# EAGLE design Multi_STM32_V0.1 (EAGLE 6.5.0)
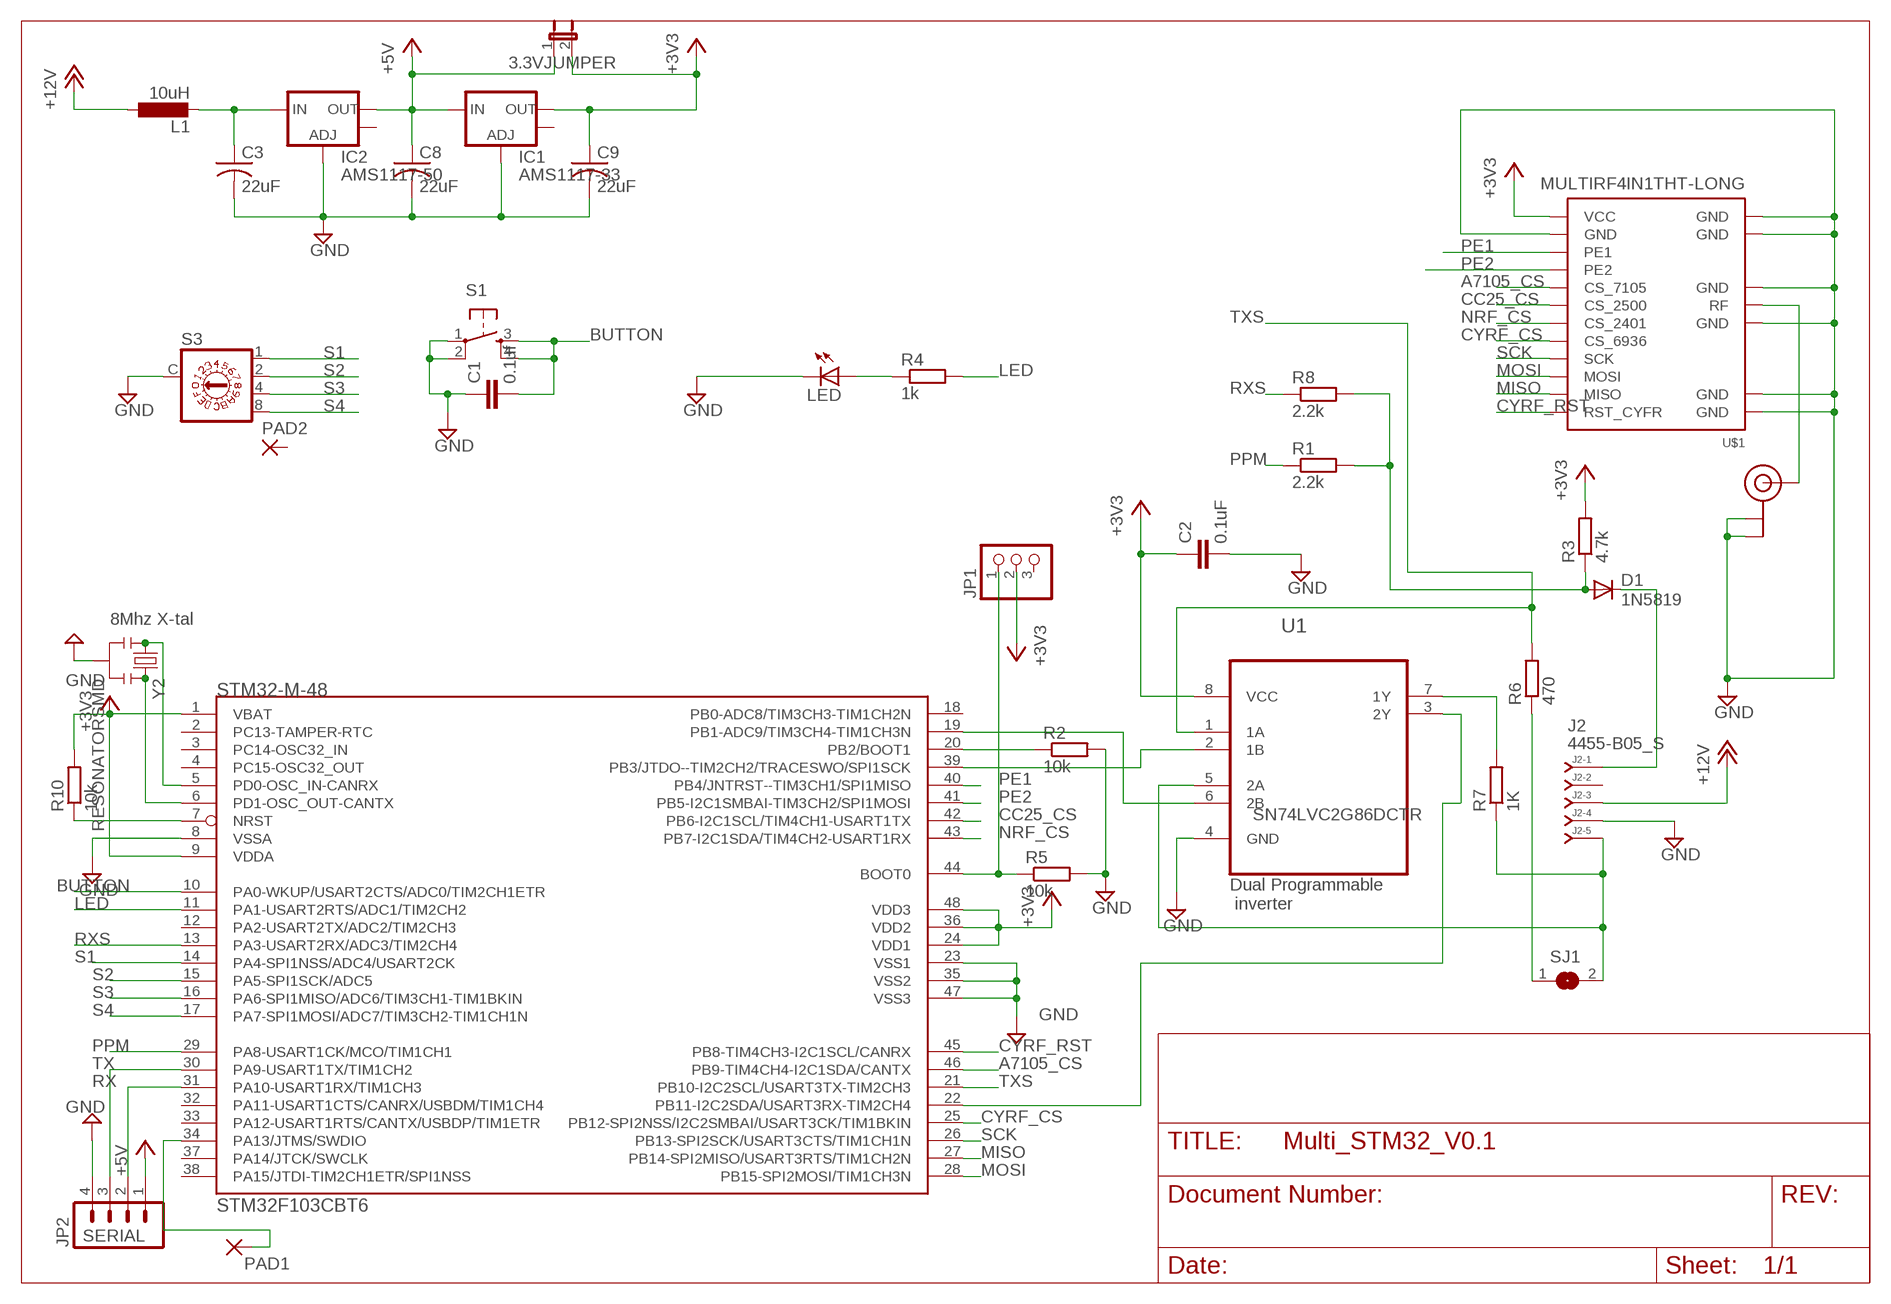
[diagram p0: schematic, sheet 1]

## Parts
3.3VJUMPER  JUMPER-2PTH  [1X02]
C1  0.1uf  C-EUC0805  [C0805]
C2  0.1uF  C-EUC0805  [C0805]
C3  22uF  C-USC1206  [C1206]
C8  22uF  C-USC1206  [C1206]
C9  22uF  C-USC1206  [C1206]
D1  1N5819  DIODESMA-ALT  [SMA-DIODE_ALT]
IC1  AMS1117-33  V_REG_LM1117SOT223  [SOT223]
IC2  AMS1117-50  V_REG_LM1117SOT223  [SOT223]
J2  4455-B05_S  [4455-B05]
JP1  PINHD-1X3  [1X03]
JP2  SERIAL  M04PTH  [1X04]
L1  10uH  L-EUL1812  [L1812]
LED  LED3MM  [LED3MM]
PAD1  SMD2  [SMD1,27-2,54]
PAD2  1,6/0,8  [1,6/0,8]
R1  2.2k  R-EU_R0805  [R0805]
R2  10k  R-EU_R0805  [R0805]
R3  4.7k  R-EU_R0805  [R0805]
R4  1k  R-EU_R0805  [R0805]
R5  10k  R-EU_R0805  [R0805]
R6  470  R-EU_R0805  [R0805]
R7  1K  R-EU_R0805  [R0805]
R8  2.2k  R-EU_R0805  [R0805]
R10  10k  R-EU_R0805  [R0805]
S1  TAC_SWITCHPTH  [TACTILE-PTH]
S3  A1353HEX  [A1353HEX]
SJ1  SJ  [SJ]
STM32F103CBT6  STM32-M-48  [LQFP48]
U1  SN74LVC2G00DCTR  [SOP65P400X130-8N]
U$1  MULTIRF4IN1THT-LONG  [MULTIRF4IN1-THT-LONG]
U$2  U.FL  [U.FL]
Y2  RESONATORSMD  [RESONATOR-SMD]

## Nets
+3V3: 3.3VJUMPER.2 C2.1 C9.1 IC1.2(OUT) JP1.2 R3.2 R10.2 STM32F103CBT6.1(VBAT) STM32F103CBT6.9(VDDA) STM32F103CBT6.24(VDD1) STM32F103CBT6.36(VDD2) STM32F103CBT6.48(VDD3) U1.8(VCC) U$1.VCC
+5V: 3.3VJUMPER.1 C8.1 IC1.3(IN) IC2.2(OUT) JP2.1
+12V: J2.3 L1.1
A7105_CS: STM32F103CBT6.46(PB9-TIM4CH4-I2C1SDA/CANTX) U$1.CS_7105
BUTTON: C1.2 S1.3 S1.4 STM32F103CBT6.10(PA0-WKUP/USART2CTS/ADC0/TIM2CH1ETR)
CC25_CS: STM32F103CBT6.42(PB6-I2C1SCL/TIM4CH1-USART1TX) U$1.CS_2500
CYRF_CS: STM32F103CBT6.25(PB12-SPI2NSS/I2C2SMBAI/USART3CK/TIM1BKIN) U$1.CS_6936
CYRF_RST: STM32F103CBT6.45(PB8-TIM4CH3-I2C1SCL/CANRX) U$1.RST_CYFR
GND: C1.1 C2.2 C3.2 C8.2 C9.2 IC1.1(ADJ) IC2.1(ADJ) J2.4 JP2.4 LED.K(C) R2.2 R5.2 S1.1 S1.2 S3.C STM32F103CBT6.8(VSSA) STM32F103CBT6.23(VSS1) STM32F103CBT6.35(VSS2) STM32F103CBT6.47(VSS3) U1.4(GND) U$1.GND U$1.GND@1(GND) U$1.GND@2(GND) U$1.GND@3(GND) U$1.GND@4(GND) U$1.GND@5(GND) U$1.GND@6(GND) U$2.P$1(GND) U$2.P$2(GND) Y2.2
LED: R4.2 STM32F103CBT6.11(PA1-USART2RTS/ADC1/TIM2CH2)
MISO: STM32F103CBT6.27(PB14-SPI2MISO/USART3RTS/TIM1CH2N) U$1.MISO
MOSI: STM32F103CBT6.28(PB15-SPI2MOSI/TIM1CH3N) U$1.MOSI
N$1: R6.1 SJ1.1
N$2: STM32F103CBT6.5(PD0-OSC_IN-CANRX) Y2.1
N$3: STM32F103CBT6.6(PD1-OSC_OUT-CANTX) Y2.3
N$4: C3.1 IC2.3(IN) L1.2
N$5: STM32F103CBT6.39(PB3/JTDO--TIM2CH2/TRACESWO/SPI1SCK) U1.2(1B)
N$6: STM32F103CBT6.22(PB11-I2C2SDA/USART3RX-TIM2CH4) U1.3(2Y)
N$8: PAD1.1(P) STM32F103CBT6.34(PA13/JTMS/SWDIO)
N$9: R7.2 U1.7(1Y)
N$10: J2.5 R7.1 SJ1.2 U1.5(2A)
N$11: LED.A R4.1
N$12: R10.1 STM32F103CBT6.7(NRST)
N$13: STM32F103CBT6.19(PB1-ADC9/TIM3CH4-TIM1CH3N) U1.6(2B)
N$15: D1.A R1.2 R3.1 R8.2
N$16: U$1.RF U$2.P$3(SIGNAL)
N$18: D1.C J2.1
N$23: JP1.1 R5.1 STM32F103CBT6.44(BOOT0)
N$26: R2.1 STM32F103CBT6.20(PB2/BOOT1)
NRF_CS: STM32F103CBT6.43(PB7-I2C1SDA/TIM4CH2-USART1RX) U$1.CS_2401
PE1: STM32F103CBT6.40(PB4/JNTRST--TIM3CH1/SPI1MISO) U$1.PE1
PE2: STM32F103CBT6.41(PB5-I2C1SMBAI-TIM3CH2/SPI1MOSI) U$1.PE2
PPM: R1.1 STM32F103CBT6.29(PA8-USART1CK/MCO/TIM1CH1)
RX: JP2.2 STM32F103CBT6.31(PA10-USART1RX/TIM1CH3)
RXS: R8.1 STM32F103CBT6.13(PA3-USART2RX/ADC3/TIM2CH4)
S1: S3.1 STM32F103CBT6.14(PA4-SPI1NSS/ADC4/USART2CK)
S2: S3.2 STM32F103CBT6.15(PA5-SPI1SCK/ADC5)
S3: S3.4 STM32F103CBT6.16(PA6-SPI1MISO/ADC6/TIM3CH1-TIM1BKIN)
S4: S3.8 STM32F103CBT6.17(PA7-SPI1MOSI/ADC7/TIM3CH2-TIM1CH1N)
SCK: STM32F103CBT6.26(PB13-SPI2SCK/USART3CTS/TIM1CH1N) U$1.SCK
TX: JP2.3 STM32F103CBT6.30(PA9-USART1TX/TIM1CH2)
TXS: R6.2 STM32F103CBT6.21(PB10-I2C2SCL/USART3TX-TIM2CH3) U1.1(1A)
Unconnected: IC1.4(OUT) IC2.4(OUT) J2.2 JP1.3 PAD2.1(P) STM32F103CBT6.2(PC13-TAMPER-RTC) STM32F103CBT6.3(PC14-OSC32_IN) STM32F103CBT6.4(PC15-OSC32_OUT) STM32F103CBT6.12(PA2-USART2TX/ADC2/TIM2CH3) STM32F103CBT6.18(PB0-ADC8/TIM3CH3-TIM1CH2N) STM32F103CBT6.32(PA11-USART1CTS/CANRX/USBDM/TIM1CH4) STM32F103CBT6.33(PA12-USART1RTS/CANTX/USBDP/TIM1ETR) STM32F103CBT6.37(PA14/JTCK/SWCLK) STM32F103CBT6.38(PA15/JTDI-TIM2CH1ETR/SPI1NSS)

## Notes on the sheet
- 8Mhz X-tal
- SN74LVC2G86DCTR
- Dual Programmable
   inverter

## Library data of the parts
3.3VJUMPER = SparkFun-Passives:JUMPER-2: Jumper Basic 0.1" spaced jumper. Use with breakaway headers.
C1 C2 = resistor:C-EU: CAPACITOR, European symbol
C3 C8 C9 = adafruit:C-US: CAPACITOR, American symbol
D1 = SparkFun-DiscreteSemi:DIODE: Diode These are standard reverse protection diodes and small signal diodes. SMA package can handle up to about 1A. SOD-323 can handle about 200mA. What the SOD-323 package when ordering, there are some mfgs out there that are 5-pin packages.
IC1 IC2 = SparkFun-PowerIC:V_REG_LM1117: Voltage Regulator LM1117 Standard adjustable voltage regulator but in SMD form. Spark Fun Electronics SKU : COM-00595
J2 = con-molex-kk:4455-B05_S: RECEPTACAL
JP1 = pinhead:PINHD-1X3: PIN HEADER
JP2 = SparkFun-Connectors:M04: Header 4 Standard 4-pin 0.1" header. Use with straight break away headers (SKU : PRT-00116), right angle break away headers (PRT-00553), swiss pins (PRT-00743), machine pins (PRT-00117), and female headers (PRT-00115). Molex polarized connector foot print use with SKU : PRT-08231 with associated crimp pins and housings. 1MM SMD Version SKU: PRT-10208
L1 = resistor:L-EU: INDUCTOR, European symbol
LED = led:LED: LED OSRAM: - CHIPLED LG R971, LG N971, LY N971, LG Q971, LY Q971, LO R971, LY R971 LH N974, LH R974 LS Q976, LO Q976, LY Q976 LO Q996 - Hyper CHIPLED LW Q18S LB Q993, LB Q99A, LB R99A - SideLED LS A670, LO A670, LY A670, LG A670, LP A670 LB A673, LV A673, LT A673, LW A673 LH A674 LY A675 LS A676, LA A676, LO A676, LY A676, LW A676 LS A679, LY A679, LG A679 - Hyper Micro SIDELED® LS Y876, LA Y876, LO Y876, LY Y876 LT Y87S - SmartLED LW L88C, LW L88S LB L89C, LB L89S, LG L890 LS L89K, LO L89K, LY L89K LS L896, LA L896, LO L896, LY L896 - TOPLED LS T670, LO T670, LY T670, LG T670, LP T670 LSG T670, LSP T670, LSY T670, LOP T670, LYG T670 LG T671, LOG T671, LSG T671 LB T673, LV T673, LT T673, LW T673 LH T674 LS T676, LA T676, LO T676, LY T676, LB T676, LH T676, LSB T676, LW T676 LB T67C, LV T67C, LT T67C, LS T67K, LO T67K, LY T67K, LW E67C LS E67B, LA E67B, LO E67B, LY E67B, LB E67C, LV E67C, LT E67C LW T67C LS T679, LY T679, LG T679 LS T770, LO T770, LY T770, LG T770, LP T770 LB T773, LV T773, LT T773, LW T773 LH T774 LS E675, LA E675, LY E675, LS T675 LS T776, LA T776, LO T776, LY T776, LB T776 LHGB T686 LT T68C, LB T68C - Hyper Mini TOPLED® LB M676 - Mini TOPLED Santana® LG M470 LS M47K, LO M47K, LY M47K Source: http://www.osram.convergy.de LUXEON: - LUMILED® LXK2-PW12-R00, LXK2-PW12-S00, LXK2-PW14-U00, LXK2-PW14-V00 LXK2-PM12-R00, LXK2-PM12-S00, LXK2-PM14-U00 LXK2-PE12-Q00, LXK2-PE12-R00, LXK2-PE12-S00, LXK2-PE14-T00, LXK2-PE14-U00 LXK2-PB12-K00, LXK2-PB12-L00, LXK2-PB12-M00, LXK2-PB14-N00, LXK2-PB14-P00, LXK2-PB14-Q00 LXK2-PR12-L00, LXK2-PR12-M00, LXK2-PR14-Q00, LXK2-PR14-R00 LXK2-PD12-Q00, LXK2-PD12-R00, LXK2-PD12-S00 LXK2-PH12-R00, LXK2-PH12-S00 LXK2-PL12-P00, LXK2-PL12-Q00, LXK2-PL12-R00 Source: www.luxeon.com KINGBRIGHT: KA-3528ASYC Source: www.kingbright.com
PAD1 = wirepad:SMD2: SMD PAD
PAD2 = wirepad:1,6/0,8: THROUGH-HOLE PAD
R1-R8 R10 = resistor:R-EU_: RESISTOR, European symbol
S1 = SparkFun-Electromechanical:TAC_SWITCH: Momentary Switch Button commonly used for reset or general input. Spark Fun Electronics SKU : COM-00097 SMT- SWCH-08247
S3 = switch-dil:A1353HEX: DIL/CODE SWITCH; OC_FARNELL: unknown; OC_NEWARK: unknown
SJ1 = jumper:SJ: SMD solder JUMPER
STM32F103CBT6 = UniversalTx:STM32-M-48: STM32F103 Medium Density 48pins
U1 = Texas Instruments_By_element14_Batch_1:SN74LVC2G00DCTR: DUAL 2-INPUT POSITIVE-NAND GATE; MPN: SN74LVC2G00DCTR; OC_FARNELL: 1595405; OC_NEWARK: 76C4187; PACKAGE: SSOP-8; SUPPLIER: Texas Instruments
U$1 = diy-multi-rf:MULTIRF4IN1
U$2 = SparkFun-Connectors:U.FL: SMD antenna connector- WRL-09144
Y2 = SparkFun-FreqCtrl:RESONATOR: Resonator Small SMD resonator. This is the itty bitty 10/20MHz resonators with built in caps. CSTCE10M0G55 and CSTCE20M0V53. Footprint has been reviewed closely but hasn't been tested yet.

## Net classes
0 default: width 0.152 mm, drill 0.33 mm

## Board
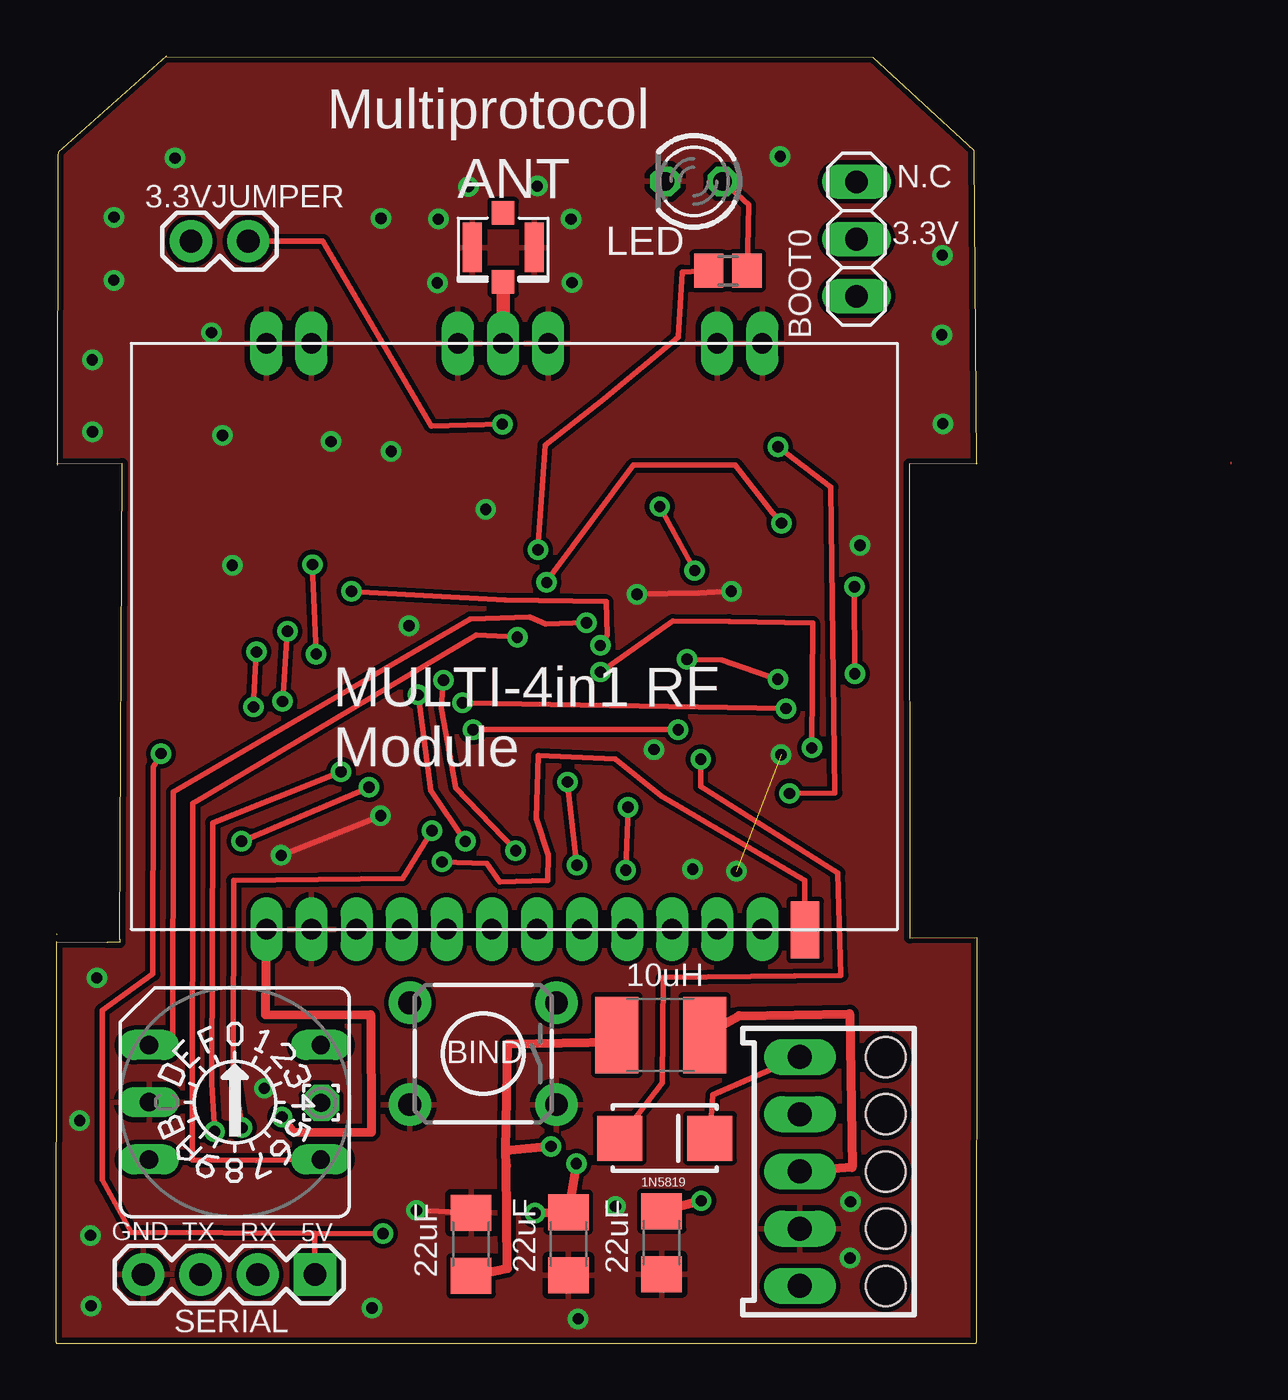
[diagram p1: board, top side]
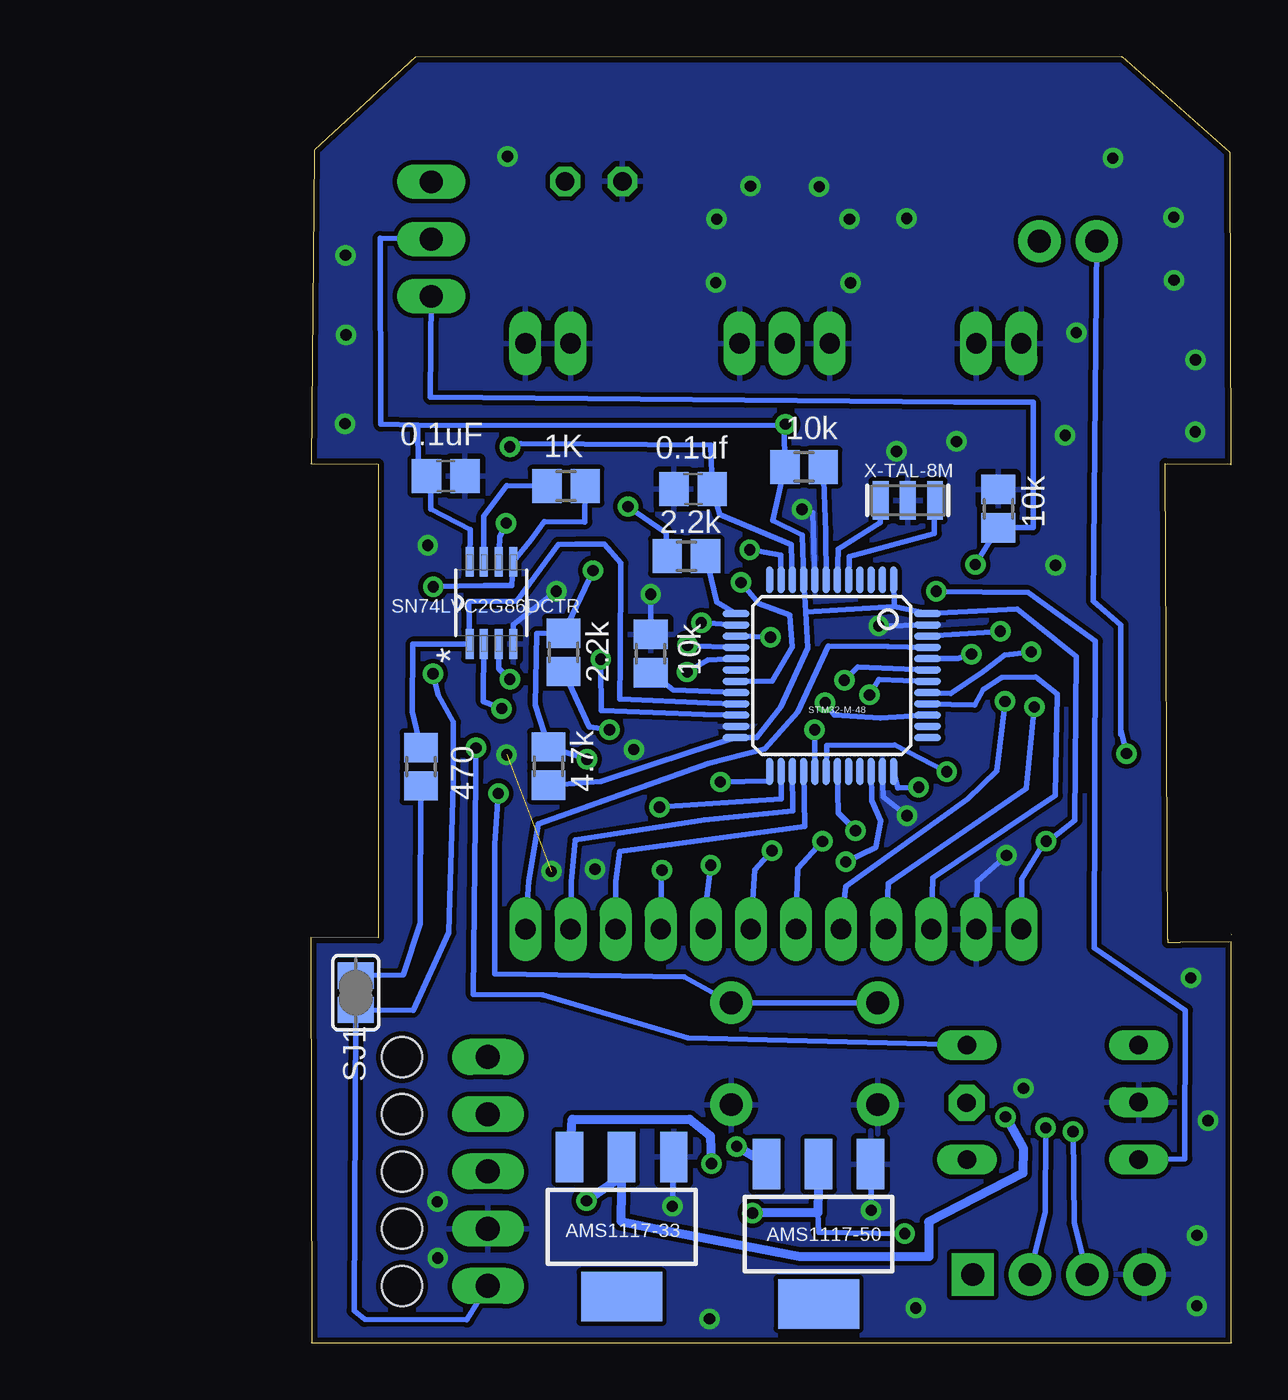
[diagram p2: board, bottom side, seen from below]

Size 40.85 x 57.11 mm. Coordinates in mm from the lower left corner, seen from the top.
Outline: 40.81,0 0,0 0,0.04 0.01,17.82
Outline: 2.82,17.92 2.93,39.04 0.05,39.02
Outline: 40.85,39.03 37.85,39.01 37.86,17.99 40.84,18 40.81,0.04 40.81,0
Outline: 0.01,17.81 2.27,17.79
Outline: 0.06,52.7 0.03,38.98
Outline: 4.89,57.1 36.22,57.08 40.69,52.95 40.7,52.79
Outline: 40.7,52.79 40.82,39.01
Outline: 4.87,57.12 0.07,52.87 0.07,52.7
Outline: 0.01,18.14 0.01,18.13
Outline: 0.03,18.19 0.03,18.19
Outline: 4.9,57.1 4.86,57.1 4.86,57.1
Outline: 0.02,17.81 0.01,17.81
Outline: 2.82,17.94 2.82,17.79 2.26,17.79
Outline: 40.81,0 40.81,0
Outline: 0.05,39.02 0.03,39.03
Copper layers (1*16): Top 0.035mm / dielectric 1.5mm / Bottom 0.035mm
Design rules "default *": minimum track width 10mil, minimum drill 24mil, track to track 8mil, track to pad 8mil, pad to pad 8mil, via to via 8mil, smd to smd 8mil, copper to edge 10mil, drill to drill 8mil, minimum pad ring 10mil, minimum via ring 8mil, stop-mask expansion 4mil, vias tented up to drill 30mil, thermal gap 10mil

### Footprints (pad centres in the part's own frame; a part is rotated, then mirrored left to right if it is on the bottom)
1X02 = drill 1.016 pad 1.88: 1 0,0; 2 2.54,0
C0805 = smd 1.3 x 1.5: 1 -0.85,0; 2 0.85,0
C1206 = smd 1.6 x 1.8: 1 -1.4,0; 2 1.4,0
SMA-DIODE_ALT = smd 2 x 2: A -2,0; C 2,0
SOT223 = smd 1.219 x 2.235: 1 -2.311,-3.099; 2 0,-3.099; 3 2.311,-3.099 | smd 3.6 x 2.2: 4 0,3.099
4455-B05 = drill 1.067 long: 1 -5.08,0; 2 -2.54,0; 3 0,0; 4 2.54,0; 5 5.08,0 | hole 1.778: -5.08,3.81; -2.54,3.81; 0,3.81; 2.54,3.81; 5.08,3.81
1X03 = drill 1.016 long: 1 -2.54,0; 2 0,0; 3 2.54,0
1X04 = drill 1.016 pad 1.88 square: 1 0,0 | drill 1.016 pad 1.88: 2 2.54,0; 3 5.08,0; 4 7.62,0
L1812 = smd 1.9 x 3.4: 1 -1.95,0; 2 1.95,0
LED3MM = drill 0.813 octagon: A -1.27,0; K 1.27,0
SMD1,27-2,54 = smd 1.27 x 2.54: 1 0,0
1,6/0,8 = drill 0.813 pad 1.6 octagon: 1 0,0
R0805 = smd 1.3 x 1.5: 1 -0.85,0; 2 0.85,0
TACTILE-PTH = drill 1.016 pad 1.88: 1 -3.251,2.261; 2 3.251,2.261; 3 -3.251,-2.261; 4 3.251,-2.261
A1353HEX = drill 0.813 long: 1 3.81,-2.54; 2 -3.81,2.54; 4 3.81,2.54; 8 -3.81,-2.54; C 3.81,0
SJ = smd 1.168 x 1.6: 1 -0.762,0; 2 0.762,0
LQFP48 = smd 0.3 x 1.2: 1 -2.75,-4.25; 2 -2.25,-4.25; 3 -1.75,-4.25; 4 -1.25,-4.25; 5 -0.75,-4.25; 6 -0.25,-4.25; 7 0.25,-4.25; 8 0.75,-4.25; 9 1.25,-4.25; 10 1.75,-4.25; 11 2.25,-4.25; 12 2.75,-4.25; 25 2.75,4.25; 26 2.25,4.25; 27 1.75,4.25; 28 1.25,4.25; 29 0.75,4.25; 30 0.25,4.25; 31 -0.25,4.25; 32 -0.75,4.25; 33 -1.25,4.25; 34 -1.75,4.25; 35 -2.25,4.25; 36 -2.75,4.25 | smd 1.2 x 0.3: 13 4.25,-2.75; 14 4.25,-2.25; 15 4.25,-1.75; 16 4.25,-1.25; 17 4.25,-0.75; 18 4.25,-0.25; 19 4.25,0.25; 20 4.25,0.75; 21 4.25,1.25; 22 4.25,1.75; 23 4.25,2.25; 24 4.25,2.75; 37 -4.25,2.75; 38 -4.25,2.25; 39 -4.25,1.75; 40 -4.25,1.25; 41 -4.25,0.75; 42 -4.25,0.25; 43 -4.25,-0.25; 44 -4.25,-0.75; 45 -4.25,-1.25; 46 -4.25,-1.75; 47 -4.25,-2.25; 48 -4.25,-2.75
SOP65P400X130-8N = smd 1.321 x 0.356: 1 -1.829,0.965; 2 -1.829,0.33; 3 -1.829,-0.33; 4 -1.829,-0.965; 5 1.829,-0.965; 6 1.829,-0.33; 7 1.829,0.33; 8 1.829,0.965
MULTIRF4IN1-THT-LONG = drill 0.9 pad 1.422 long: CS_2401 13,1; CS_2500 13,-1; CS_6936 13,3; CS_7105 13,-3; GND 13,-9; GND@1 -13,11; GND@2 -13,9; GND@3 -13,1.5; GND@4 -13,-2.5; GND@5 -13,-9; GND@6 -13,-11; MISO 13,9; MOSI 13,7; PE1 13,-7; PE2 13,-5; RF -13,-0.5; RST_CYFR 13,11; SCK 13,5; VCC 13,-11
U.FL = smd 2.2 x 0.85: P$1 0,1.375; P$2 0,-1.375 | smd 1.05 x 1: P$3 1.525,0; P$4 -1.525,0
RESONATOR-SMD = smd 0.7 x 1.7: 1 -1.2,0; 2 0,0; 3 1.2,0

### Placement (x,y rotation side)
3.3VJUMPER  5.98,48.91 0 top
C1  23.88,37.91 0 bottom
C2  34.86,38.48 0 bottom
C3  18.4,4.39 90 top
C8  22.72,4.41 270 top
C9  26.85,4.46 270 top
D1  26.99,9.1 0 top
IC1  27.05,5.16 180 bottom
IC2  18.31,4.84 180 bottom
J2  32.99,7.62 270 top
JP1  35.5,49 90 top
JP2  11.47,3.05 180 top
L1  26.81,13.68 180 top
LED  28.29,51.57 180 top
PAD1  33.22,18.34 0 top
PAD2  11.75,10.67 0 top
R1  29.63,30.66 90 bottom
R2  25.77,30.61 90 bottom
R3  30.3,25.61 270 bottom
R4  29.8,47.6 180 top
R5  10.34,37.04 90 bottom
R6  35.96,25.58 90 bottom
R7  29.52,38.04 180 bottom
R8  24.18,34.93 180 bottom
R10  18.96,38.89 180 bottom
S1  18.94,12.85 180 top
S3  7.92,10.69 180 top
SJ1  38.85,15.56 270 bottom
STM32F103CBT6  17.73,29.63 180 bottom
U1  32.83,32.86 90 bottom
U$1  20.32,31.37 270 top
U$2  19.82,48.63 270 top
Y2  14.35,37.4 180 bottom

### Tracks (layer width: path | path; a pad name or v marks a point on that pad's centre or on a via)
+3V3  (via drill 0.5)
  Top 0.254: v13.87,24.67 13.15,24.36 v8.22,22.27 | 3.3VJUMPER.2 11.82,48.91 16.64,40.71 v19.79,40.79
  Top 0.406: v28.61,6.32 C9.1 | U$1.VCC 9.28,14.59 13.94,14.58 13.98,9.37 10.55,9.35 v10.02,10.04
  Bottom 0.254: IC1.2 27.16,7.32 | STM32F103CBT6.1 14.97,32.7 | 14.97,32.7 STM32F103CBT6.48 9.51,32.57 6.89,30.47 6.94,23.21 8.4,22.04 | 18.89,32.44 STM32F103CBT6.9 19.03,35.86 20.34,36.5 R10.2 19.83,40.72 | 18.89,32.44 14.97,32.7 | 18.89,32.44 18.79,30.85 20,28.25 21.06,26.88 STM32F103CBT6.24 23.94,26.26 27.98,24.93 R3.2 | 8.4,22.04 9.3,20.6 U$1.VCC | 19.83,40.72 36.1,40.74 | 36.1,40.74 37.74,40.79 37.77,49.04 JP1.2 | v8.22,22.27 8.4,22.04 | v19.79,40.79 19.83,40.72 | 35.51,38.37 36.08,38.88 36.1,40.74 | U1.8 33.76,36.11 35.51,37.02 35.51,38.37 | 35.51,38.37 C2.1 | v13.87,24.67 14.81,24.64 STM32F103CBT6.36
  Bottom 0.406: 27.16,7.32 v28.61,6.32 | IC1.2 27.09,5.42 25.82,5.14 19.14,3.85 13.42,3.85 13.43,5.38 9.25,7.54 9.23,8.64 v10.02,10.04
+5V  (via drill 0.5)
  Top 0.254: v14.49,4.87 11.47,4.88 | 11.47,4.88 JP2.1 | 11.47,4.88 3.33,4.91 2.03,7.25 2.04,14.77 4.28,16.39 4.29,25.58 v4.65,26.17
  Top 0.406: v21.24,5.78 C8.1 v23.07,7.97
  Bottom 0.254: 18.35,5.8 18.31,4.92 v14.49,4.87 | 3.3VJUMPER.1 6.12,32.95 4.9,31.88 4.9,27.21 | 4.9,27.21 4.9,27.02 | v4.65,26.17 4.9,27.21
  Bottom 0.406: IC2.2 18.35,5.8 v21.24,5.78 | IC1.3 29.23,9.94 24.03,9.94 23.12,9.2 v23.07,7.97
+12V
  Top 0.406: L1.1 30.28,14.53 35.2,14.62 35.3,7.8 J2.3
A7105_CS  (via drill 0.5)
  Top 0.254: v10.04,28.48 v10.25,31.59
  Bottom 0.254: U$1.CS_7105 17.1,20.27 11.7,24.16 10.41,25.39 v10.04,28.48 | v10.25,31.59 STM32F103CBT6.46
BUTTON  (via drill 0.5)
  Top 0.254: v32.52,24.4 34.55,24.43 34.36,38 v32.01,39.78
  Bottom 0.254: v32.52,24.4 32.69,22.13 32.69,16.4 24.28,16.26 S1.3 S1.4 | STM32F103CBT6.10 19.53,35.45 22.7,36.77 C1.2 23.11,39.87 31.54,39.92 v32.01,39.78
CC25_CS  (via drill 0.5)
  Top 0.254: v16.05,28.77 16.62,24.54 v18.15,22.27
  Bottom 0.254: U$1.CS_2500 19.24,21.06 v18.15,22.27 | STM32F103CBT6.42 15.65,29.46 v16.05,28.77
CYRF_CS  (via drill 0.5)
  Top 0.254: 23.33,18.31 U$1.CS_6936 | v23.1,21.21 v22.67,24.91
  Bottom 0.254: U$1.CS_6936 23.27,19.76 v23.1,21.21 | v22.67,24.91 20.48,24.94 STM32F103CBT6.25
CYRF_RST
  Bottom 0.254: U$1.RST_CYFR 31.18,20.5 30.76,23.05 23.2,25.74 20.71,26.37 19.25,28.02 17.89,30.94 15.25,30.93 STM32F103CBT6.45
GND  (via drill 0.5)  (1 unrouted)
  Top 0.254: v15.98,5.9 C3.2 | v9.97,21.65 v14.39,23.41 | v29.95,33.37 28.5,33.3 v25.76,33.24
  Bottom 0.254: v24.8,6.07 IC1.1 | IC2.1 v15.98,5.9 | R2.2 25.75,33.25 | STM32F103CBT6.47 15.62,31.84 | STM32F103CBT6.8 18.57,36.86 18.99,37.01 | U$1.GND 11.27,20.48 v9.97,21.65 | v14.39,23.41 15.46,24.25 STM32F103CBT6.35 | U1.4 31.85,31.9 31.14,32.44 v29.95,33.37
  other vias: 5.26,52.6 18.29,51.33 1.52,4.78 1.54,1.66 1.8,16.21 1.03,9.88 21.34,51.35 32.11,52.68 39.31,48.29 39.29,44.75 2.56,49.97 1.6,40.45 14,1.56 23.15,1.08 1.6,43.64 2.55,47.18 14.41,49.92 9.22,11.31 22.88,47.07 16.9,47.06 16.95,49.89 22.84,49.89 35.21,3.77 35.23,6.28 6.88,44.85 39.33,40.81 19.05,37.01 15.64,31.84 14.85,39.58 12.19,40.02 7.81,34.52 7.37,40.29 26.51,26.35 28.23,21.04 30.17,20.94 35.65,35.41 32.15,26.12
  pour Top: -0.04,-0.09 40.9,0.04 40.74,17.99 37.69,17.96 37.7,39.18 40.89,39.16 40.87,52.51 35.94,57.08 5.04,57.03 0.04,52.49 0.03,39.16 3.01,39.12 2.99,17.77 -0.01,17.79
  pour Bottom: 0,-0.02 40.94,0.09 40.74,17.98 37.69,17.99 37.74,39.15 40.9,39.15 40.86,52.53 35.97,57.06 5.03,57.03 0.01,52.48 0.03,39.17 3.01,39.12 3,17.77 -0.01,17.79 0,-0.01
LED  (via drill 0.5)
  Top 0.254: v21.37,35.22 21.69,39.86 24.29,41.91 27.59,44.65 27.77,47.54 R4.2
  Bottom 0.254: STM32F103CBT6.11 19.99,34.97 v21.37,35.22
MISO
  Bottom 0.254: U$1.MISO 29.29,20.46 29.11,22.34 23.38,23.23 19.46,23.61 STM32F103CBT6.27
MOSI
  Bottom 0.254: U$1.MOSI 27.32,20.5 27.13,21.82 18.92,22.94 STM32F103CBT6.28
N$1
  Bottom 0.254: SJ1.1 36.74,16.36 35.98,18.64 R6.1
N$2
  Bottom 0.254: STM32F103CBT6.5 16.95,34.91 13.18,35.94 Y2.1
N$3
  Bottom 0.254: STM32F103CBT6.6 17.45,35.24 15.58,36.42 Y2.3
N$4  (via drill 0.5)
  Top 0.254: 24.85,13.38 L1.2
  Top 0.406: C3.1 20.02,3.32 19.96,7.88 19.94,8.53 | 19.94,8.53 20.02,13.28 24.85,13.38 | v21.95,8.73 19.94,8.53
  Bottom 0.406: IC2.3 v21.95,8.73
N$5  (via drill 0.5)
  Top 0.254: v18.02,28.42 v32.38,28.17
  Bottom 0.254: STM32F103CBT6.39 15.58,27.76 17.63,27.88 v18.02,28.42 | v32.38,28.17 33.18,28.49 U1.2
N$6  (via drill 0.5)
  Top 0.254: v32.01,29.46 29.53,30.32 v27.98,30.35
  Bottom 0.254: STM32F103CBT6.22 23.4,27.9 27.96,28.09 27.98,30.06 v27.98,30.35 | U1.3 32.49,29.93 v32.01,29.46
N$7
  Top 0: 52.13,39.01 52.13,39.11
N$8  (via drill 0.5)
  Top 0.254: PAD1.1 33.2,20.54 26.85,24.28 24.81,25.94 21.38,26.08 21.29,23.3 21.84,21.68 21.81,20.53 19.68,20.47 19.09,21.28 v17.11,21.36
  Bottom 0.254: v17.11,21.36 15.79,22.01 15.55,23.17 15.95,24.09 STM32F103CBT6.34
N$9
  Bottom 0.254: U1.7 33.16,36.71 32.15,38.07 R7.2
N$10  (via drill 0.5)
  Top 0.254: v35.41,33.58 v35.42,29.71
  Bottom 0.254: J2.5 33.92,1.03 38.46,1.06 38.92,1.44 SJ1.2 36.3,14.78 34.71,18.23 34.52,24.87 34.52,27.56 35.18,28.77 v35.42,29.71 | v35.41,33.58 33.16,33.62 31.92,33.63 U1.5 31.07,35.66 30.48,36.47 28.68,36.45 R7.1
N$11
  Top 0.254: R4.1 30.72,50.53 LED.A
N$12
  Bottom 0.254: STM32F103CBT6.7 18,36.01 R10.1
N$13  (via drill 0.5)
  Top 0.254: v32.17,36.4 31.76,36.87 30.13,38.97 25.6,38.97 22.02,34.18 v21.75,33.76
  Bottom 0.254: U1.6 32.46,35.78 v32.17,36.4 | STM32F103CBT6.19 20.37,29.4 19.49,30.9 19.58,32.32 20.98,32.83 v21.75,33.76
N$15  (via drill 0.5)
  Top 0.254: D1.A 26.88,11.54 26.93,16.23 32.77,16.29 34.81,16.33 34.67,20.86 28.58,24.7 v28.59,25.92 | v28.32,34.29 v26.77,37.13
  Bottom 0.254: v28.32,34.29 R1.2 30.82,31.49 30.88,28.33 R3.1 v28.59,25.92 | v26.77,37.13 25.08,35.95 R8.2
N$16
  Top 0.61: U$1.RF U$2.P$3
N$18
  Top 0.254: J2.1 29.13,11.03 D1.C
N$23  (via drill 0.5)
  Top 0.254: v11.53,30.58 v11.36,34.56
  Bottom 0.254: STM32F103CBT6.44 12.15,30.38 v11.53,30.58 | v11.36,34.56 R5.1 9.63,36.2 8.79,36.19 8.8,41.77 12.26,41.77 35.54,41.98 JP1.1
N$26
  Bottom 0.254: STM32F103CBT6.20 24.75,28.98 R2.1
NRF_CS  (via drill 0.5)
  Top 0.254: v17.17,29.43 17.09,28.2 17.73,24.65 v20.38,21.86
  Bottom 0.254: U$1.CS_2401 21.14,21 v20.38,21.86 | STM32F103CBT6.43 16.57,30.01 v17.17,29.43
PE1
  Bottom 0.254: U$1.PE1 13.24,20.65 7.81,24.3 7.73,28.8 8.67,29.56 10.18,29.55 11,29 11.38,28.31 STM32F103CBT6.40
PE2  (via drill 0.5)
  Top 0.254: v8.74,28.24 v8.88,30.68
  Bottom 0.254: U$1.PE2 15.22,20.4 9.11,24.61 v8.74,28.24 | v8.88,30.68 10.06,30.55 11.01,29.82 12.44,28.84 STM32F103CBT6.41
PPM  (via drill 0.5)
  Top 0.254: v18.49,27.23 v27.59,27.23
  Bottom 0.254: STM32F103CBT6.29 v18.49,27.23 | v27.59,27.23 28.49,27.36 R1.1
RX  (via drill 0.5)
  Top 0.254: v8.24,9.56 7.84,12.05 7.86,20.53 15.37,20.62 v16.67,22.75
  Bottom 0.254: STM32F103CBT6.31 17.44,23.54 v16.67,22.75 | v8.24,9.56 8.25,5.82 JP2.2
RXS
  Bottom 0.254: STM32F103CBT6.13 22.84,32.89 R8.1
S1  (via drill 0.5)
  Top 0.254: v23.52,31.98 21.72,31.91 21.01,32.24 18.36,32.15 5.19,24.46 5.16,13.21 S3.1
  Bottom 0.254: STM32F103CBT6.14 v23.52,31.98
S2  (via drill 0.5)
  Top 0.254: v20.45,31.34 18.63,31.43 6.04,23.96 6.04,8.14 8.88,8.11 S3.2
  Bottom 0.254: STM32F103CBT6.15 v20.45,31.34
S3  (via drill 0.5)
  Top 0.254: v24.14,30.97 24.45,31.43 24.39,32.91 19.91,32.98 v13.09,33.37
  Bottom 0.254: S3.4 2.06,8.18 2.04,14.77 6.08,17.55 6.03,31.16 9.01,33.31 v13.09,33.37 | STM32F103CBT6.16 v24.14,30.97
S4  (via drill 0.5)
  Top 0.254: v24.14,29.79 27.35,32.04 29.85,32.04 33.55,31.96 v33.52,26.42
  Bottom 0.254: STM32F103CBT6.17 23.23,30.33 v24.14,29.79 | S3.8 24.11,13.55 30.56,15.45 33.63,15.48 33.53,25.06 v33.52,26.42
SCK  (via drill 0.5)
  Top 0.254: v25.26,20.99 v25.37,23.79
  Bottom 0.254: U$1.SCK 25.29,20.28 v25.26,20.99 | v25.37,23.79 19.97,24.16 STM32F103CBT6.26
TX  (via drill 0.5)
  Top 0.254: v12.63,25.36 6.94,23.1 6.89,11.54 v7.02,9.39
  Bottom 0.254: STM32F103CBT6.30 17.95,26.53 14.94,26.54 v12.63,25.36 | v7.02,9.39 6.97,5.33 JP2.3
TXS
  Bottom 0.254: STM32F103CBT6.21 23.21,28.41 27.14,28.6 27.11,30.24 27.09,34.62 27.83,35.46 29.09,35.47 29.87,35.45 31.7,32.95 33.83,32.91 U1.1 36.31,31.03 36.33,28.04 R6.2

### Text on the board
tPlace: Multiprotocol | N.C | ANT | 3.3V | BOOT0 | MULTI-4in1 RF / Module | BIND | GND | TX | RX | 5V
bPlace: X-TAL-8M | SN74LVC2G86DCTR